# EAGLE design mult (EAGLE 7.1.0)
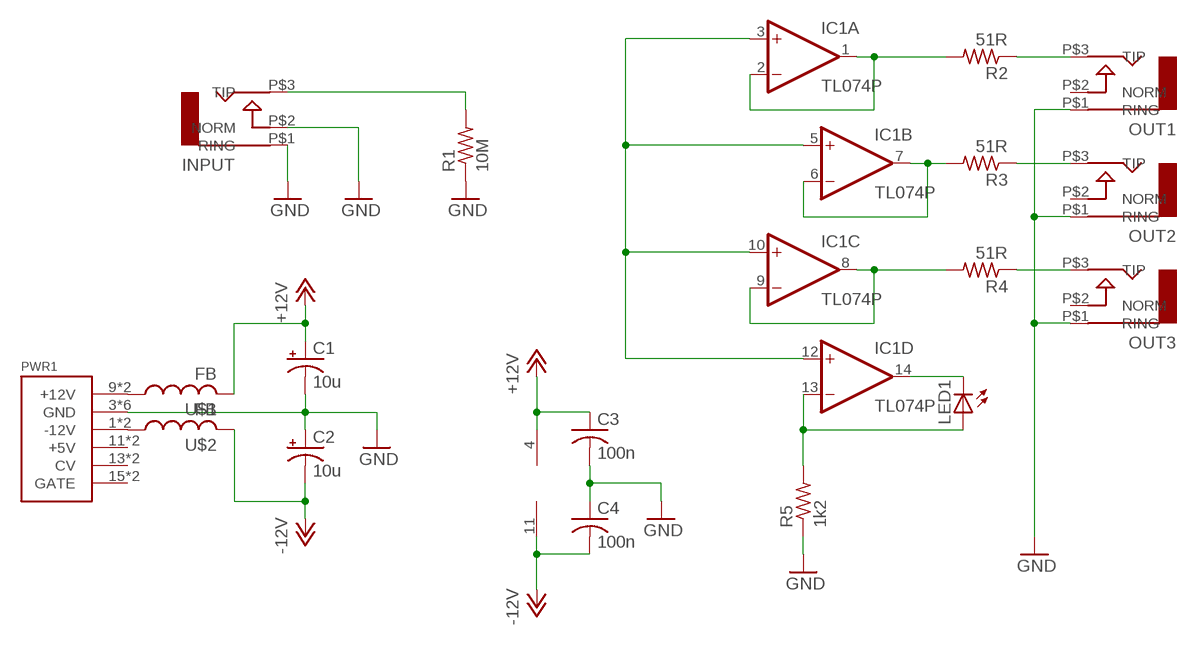
[diagram p0: schematic, sheet 1]

## Parts
C1  10u  CPOL-USB45181A  [B45181A]
C2  10u  CPOL-USB45181A  [B45181A]
C3  100n  C-US050-024X044  [C050-024X044]
C4  100n  C-US050-024X044  [C050-024X044]
IC1  TL074P  [DIL14]
INPUT  AUDIO-JACK  [ERTHENVAR-JACK-90DEG]
LED1  LED5MM  [LED5MM]
OUT1  AUDIO-JACK  [ERTHENVAR-JACK-90DEG]
OUT2  AUDIO-JACK  [ERTHENVAR-JACK-90DEG]
OUT3  AUDIO-JACK  [ERTHENVAR-JACK-90DEG]
PWR1  POWER  [POWER_16]
R1  10M  R-US_0207/10  [0207/10]
R2  51R  R-US_0207/10  [0207/10]
R3  51R  R-US_0207/10  [0207/10]
R4  51R  R-US_0207/10  [0207/10]
R5  1k2  R-US_0207/10  [0207/10]
U$1  FB  [FB]
U$2  FB  [FB]

## Nets
+12V: C1.+ C3.1 IC1.4(P:V+) U$1.P$2
-12V: C2.- C4.2 IC1.11(P:V-) U$2.P$2
GND: C1.- C2.+ C3.2 C4.1 INPUT.P$1(RING) INPUT.P$2(NORM) OUT1.P$1(RING) OUT2.P$1(RING) OUT3.P$1(RING) PWR1.3(GND) PWR1.4(GND) PWR1.5(GND) PWR1.6(GND) PWR1.7(GND) PWR1.8(GND) R1.1 R5.1
N$1: PWR1.9(+12V) PWR1.10(+12V) U$1.P$1
N$2: PWR1.1(-12V) PWR1.2(-12V) U$2.P$1
N$3: OUT1.P$3(TIP) R2.1
N$4: OUT2.P$3(TIP) R3.1
N$5: OUT3.P$3(TIP) R4.1
N$6: IC1.3(A:+IN) IC1.5(B:+IN) IC1.10(C:+IN) IC1.12(D:+IN)
N$7: IC1.1(A:OUT) IC1.2(A:-IN) R2.2
N$8: IC1.6(B:-IN) IC1.7(B:OUT) R3.2
N$9: IC1.8(C:OUT) IC1.9(C:-IN) R4.2
N$10: IC1.14(D:OUT) LED1.K(C)
N$11: IC1.13(D:-IN) LED1.A R5.2
N$12: INPUT.P$3(TIP) R1.2
Unconnected: OUT1.P$2(NORM) OUT2.P$2(NORM) OUT3.P$2(NORM) PWR1.11(+5V) PWR1.12(+5V) PWR1.13(CV) PWR1.14(CV) PWR1.15(GATE) PWR1.16(GATE)

## Library data of the parts
C1 C2 = rcl:CPOL-US: POLARIZED CAPACITOR, American symbol
C3 C4 = rcl:C-US: CAPACITOR, American symbol
IC1 = linear:TL074: OP AMP
INPUT OUT1-OUT3 = erthenvar:AUDIO-JACK: Switching Mono 3.5mm Audio Jack from Erthenvar.
LED1 = led:LED: LED OSRAM: - CHIPLED LG R971, LG N971, LY N971, LG Q971, LY Q971, LO R971, LY R971 LH N974, LH R974 LS Q976, LO Q976, LY Q976 LO Q996 - Hyper CHIPLED LW Q18S LB Q993, LB Q99A, LB R99A - SideLED LS A670, LO A670, LY A670, LG A670, LP A670 LB A673, LV A673, LT A673, LW A673 LH A674 LY A675 LS A676, LA A676, LO A676, LY A676, LW A676 LS A679, LY A679, LG A679 - Hyper Micro SIDELED® LS Y876, LA Y876, LO Y876, LY Y876 LT Y87S - SmartLED LW L88C, LW L88S LB L89C, LB L89S, LG L890 LS L89K, LO L89K, LY L89K LS L896, LA L896, LO L896, LY L896 - TOPLED LS T670, LO T670, LY T670, LG T670, LP T670 LSG T670, LSP T670, LSY T670, LOP T670, LYG T670 LG T671, LOG T671, LSG T671 LB T673, LV T673, LT T673, LW T673 LH T674 LS T676, LA T676, LO T676, LY T676, LB T676, LH T676, LSB T676, LW T676 LB T67C, LV T67C, LT T67C, LS T67K, LO T67K, LY T67K, LW E67C LS E67B, LA E67B, LO E67B, LY E67B, LB E67C, LV E67C, LT E67C LW T67C LS T679, LY T679, LG T679 LS T770, LO T770, LY T770, LG T770, LP T770 LB T773, LV T773, LT T773, LW T773 LH T774 LS E675, LA E675, LY E675, LS T675 LS T776, LA T776, LO T776, LY T776, LB T776 LHGB T686 LT T68C, LB T68C - Hyper Mini TOPLED® LB M676 - Mini TOPLED Santana® LG M470 LS M47K, LO M47K, LY M47K Source: http://www.osram.convergy.de LUXEON: - LUMILED® LXK2-PW12-R00, LXK2-PW12-S00, LXK2-PW14-U00, LXK2-PW14-V00 LXK2-PM12-R00, LXK2-PM12-S00, LXK2-PM14-U00 LXK2-PE12-Q00, LXK2-PE12-R00, LXK2-PE12-S00, LXK2-PE14-T00, LXK2-PE14-U00 LXK2-PB12-K00, LXK2-PB12-L00, LXK2-PB12-M00, LXK2-PB14-N00, LXK2-PB14-P00, LXK2-PB14-Q00 LXK2-PR12-L00, LXK2-PR12-M00, LXK2-PR14-Q00, LXK2-PR14-R00 LXK2-PD12-Q00, LXK2-PD12-R00, LXK2-PD12-S00 LXK2-PH12-R00, LXK2-PH12-S00 LXK2-PL12-P00, LXK2-PL12-Q00, LXK2-PL12-R00 Source: www.luxeon.com KINGBRIGHT: KA-3528ASYC Source: www.kingbright.com
PWR1 = eurorack:POWER
R1-R5 = rcl:R-US_: RESISTOR, American symbol
U$1 U$2 = adafruit:FB: Ferrite bead Digikey #P9821BK-ND

## Board
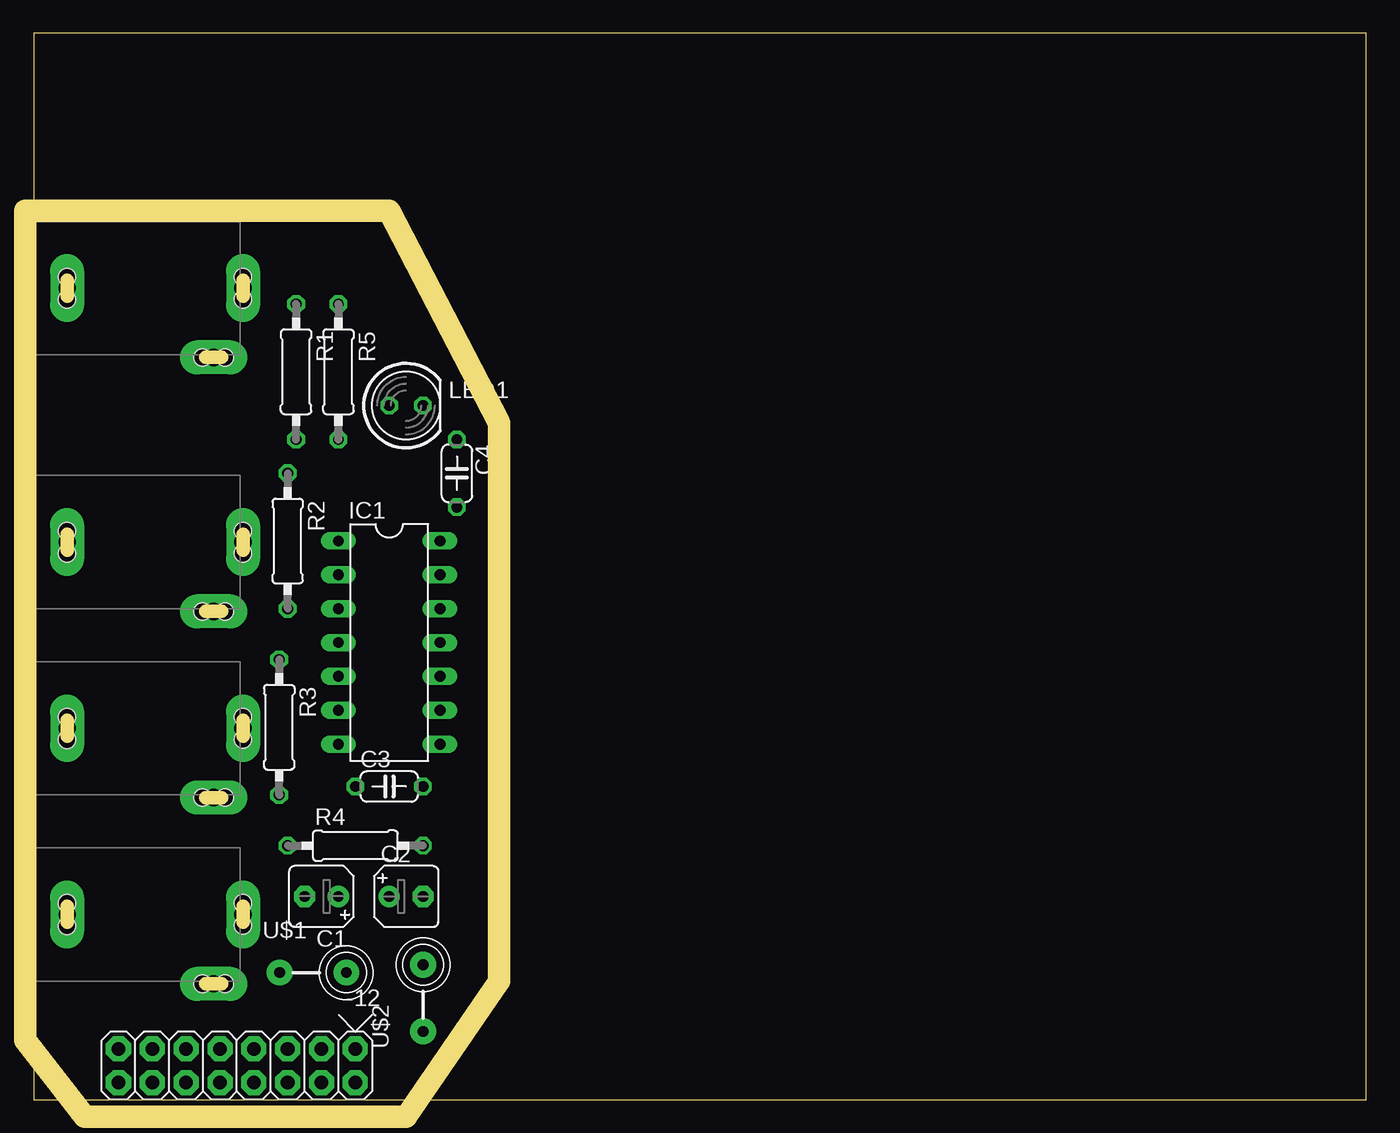
[diagram p1: board, top side]
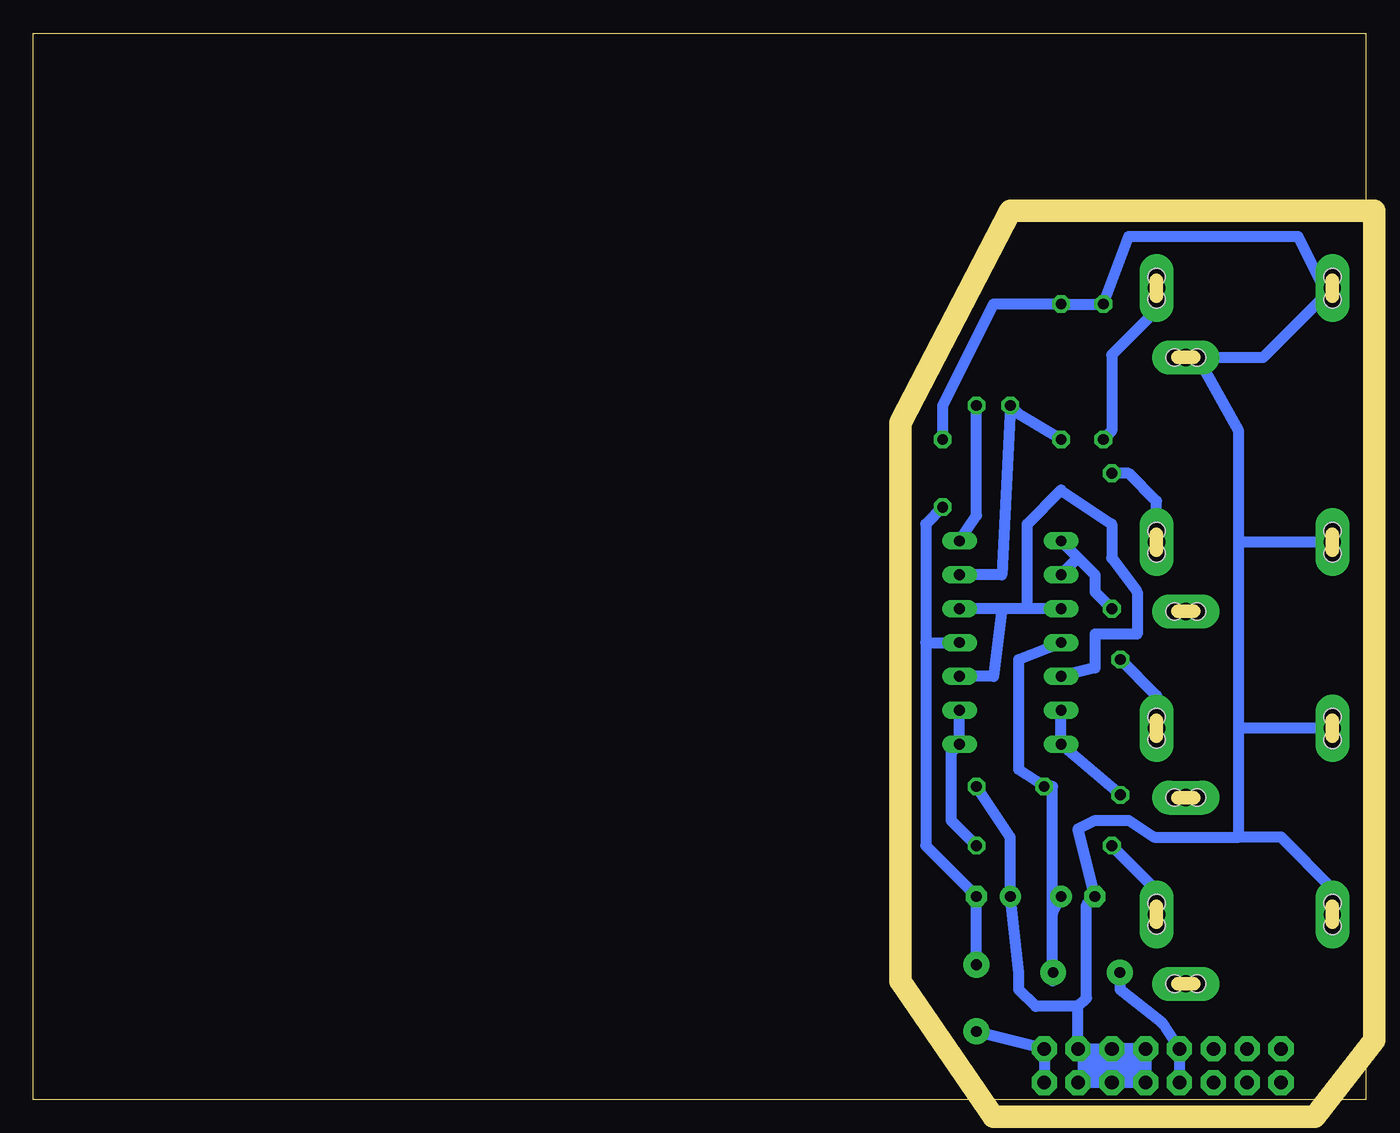
[diagram p2: board, bottom side, seen from below]

Size 100 x 80 mm. Coordinates in mm from the lower left corner, seen from the top.
Outline: 0,0 100,0 100,80 0,80 0,0
Copper layers (1*16): Top 0.035mm / dielectric 1.5mm / Bottom 0.035mm
Design rules "default *": minimum track width 32mil, minimum drill 32mil, track to track 16mil, track to pad 16mil, pad to pad 16mil, via to via 16mil, smd to smd 8mil, copper to edge 0mil, drill to drill 16mil, minimum pad ring 10mil, minimum via ring 8mil, stop-mask expansion 4mil, vias tented up to drill 0mil, thermal gap 10mil
Milling: 7 lines

### Footprints (pad centres in the part's own frame; a part is rotated, then mirrored left to right if it is on the bottom)
B45181A = drill 0.813 pad 1.6: + -1.27,0 | drill 0.813 pad 1.6 octagon: - 1.27,0
C050-024X044 = drill 0.813 octagon: 1 -2.54,0; 2 2.54,0
DIL14 = drill 0.813 long: 1 -7.62,-3.81; 2 -5.08,-3.81; 3 -2.54,-3.81; 4 0,-3.81; 5 2.54,-3.81; 6 5.08,-3.81; 7 7.62,-3.81; 8 7.62,3.81; 9 5.08,3.81; 10 2.54,3.81; 11 0,3.81; 12 -2.54,3.81; 13 -5.08,3.81; 14 -7.62,3.81
ERTHENVAR-JACK-90DEG = drill 1.3 pad 2.54 long: P$1 5,-2.5; P$2 -0.2,-13.5; P$3 5,-15.7 | hole 1.3: 5.842,-2.489; 4.14,-2.489; -0.203,-12.649; -0.203,-14.351; 5.842,-15.697; 4.166,-15.697
LED5MM = drill 0.813 octagon: A -1.27,0; K 1.27,0
POWER_16 = drill 1.016 pad 1.88 octagon: 1 -6.35,-1.27; 2 -6.35,1.27; 3 -3.81,-1.27; 4 -3.81,1.27; 5 -1.27,-1.27; 6 -1.27,1.27; 7 1.27,-1.27; 8 1.27,1.27; 9 3.81,-1.27; 10 3.81,1.27; 11 6.35,-1.27; 12 6.35,1.27; 13 8.89,-1.27; 14 8.89,1.27; 15 11.43,-1.27; 16 11.43,1.27
0207/10 = drill 0.813 octagon: 1 -5.08,0; 2 5.08,0
FB = drill 0.8 pad 1.93: P$1 -2.5,0; P$2 2.5,0

### Placement (x,y rotation side)
C1  21.59,15.24 180 top
C2  27.94,15.24 0 top
C3  26.67,23.5 0 top
C4  31.75,46.99 270 top
IC1  26.67,34.29 270 top
INPUT  0,55.88 90 top
LED1  27.94,52.07 0 top
OUT1  0,36.83 90 top
OUT2  0,22.86 90 top
OUT3  0,8.89 90 top
PWR1  17.78,2.54 180 top
R1  19.68,54.61 270 top
R2  19.05,41.91 270 top
R3  18.41,27.94 270 top
R4  24.13,19.05 0 top
R5  22.86,54.61 270 top
U$1  20.95,9.53 0 top
U$2  29.21,7.62 90 top

### Tracks (layer width: path | path; a pad name or v marks a point on that pad's centre or on a via)
+12V
  Bottom 0.813: 23.5,13.97 23.5,8.89 U$1.P$2 | 23.5,13.97 23.5,23.5 C3.1 26.04,24.77 26.04,33.02 IC1.4 | 23.5,13.97 C1.+
-12V
  Bottom 0.813: U$2.P$2 C2.- 33.02,19.05 33.02,34.29 | 33.02,34.29 IC1.11 | 33.02,34.29 33.02,43.18 C4.2
GND
  Bottom 0.813: C3.2 26.67,19.68 C2.+ 26.04,9.53 26.04,8.26 24.77,6.99 21.59,6.99 | PWR1.4 PWR1.6 PWR1.8 PWR1.7 PWR1.5 PWR1.3 21.59,6.99 | 21.59,6.99 20.95,7.62 20.95,14.61 C1.- 21.59,20.32 20.32,20.95 17.78,20.95 15.88,19.68 9.53,19.68 | 9.53,19.68 9.53,27.94 | 9.53,27.94 9.53,41.91 | 9.53,41.91 9.53,50.16 12.7,55.88 13.7,55.88 INPUT.P$2 7.7,55.68 INPUT.P$1 2.54,60.92 2.54,59.69 5.08,64.77 17.78,64.77 R1.1 R5.1 27.94,59.69 31.75,52.07 C4.1 | OUT1.P$1 9.45,41.83 9.53,41.91 | OUT2.P$1 9.45,27.86 9.53,27.94 | OUT3.P$1 2.5,15.84 6.35,19.68 9.53,19.68
N$1
  Bottom 0.813: PWR1.10 PWR1.9 15.24,5.71 18.41,8.26 U$1.P$1
N$2
  Bottom 0.813: PWR1.2 PWR1.1 29.21,5.08 U$2.P$1
N$3
  Bottom 0.813: OUT1.P$3 15.7,44.91 17.78,46.99 R2.1
N$4
  Bottom 0.813: OUT2.P$3 15.7,30.3 R3.1
N$5
  Bottom 0.813: OUT3.P$3 15.7,15.7 R4.1
N$6
  Bottom 0.813: 25.4,36.83 25.4,43.18 22.86,45.72 19.05,43.18 19.05,40.64 17.14,38.1 17.14,34.92 20.32,34.92 20.32,32.38 IC1.5 | IC1.3 25.4,36.83 | IC1.10 27.94,31.75 27.3,36.83 | 25.4,36.83 27.3,36.83 | 27.3,36.83 IC1.12
N$7
  Bottom 0.813: R2.2 20.32,38.1 20.32,39.37 21.59,40.64 | IC1.1 21.59,40.64 | 21.59,40.64 IC1.2
N$8
  Bottom 0.813: R3.2 IC1.7 IC1.6
N$9
  Bottom 0.813: R4.2 31.11,20.95 31.11,26.04 IC1.8 IC1.9
N$10
  Bottom 0.813: LED1.K 29.21,43.81 IC1.14
N$11
  Bottom 0.813: R5.2 26.04,51.44 LED1.A 27.3,39.37 IC1.13
N$12
  Bottom 0.813: INPUT.P$3 15.7,59.23 19.05,55.88 19.05,50.16 R1.2
(copper drawn outside any net)
  shapes: Bottom area x1